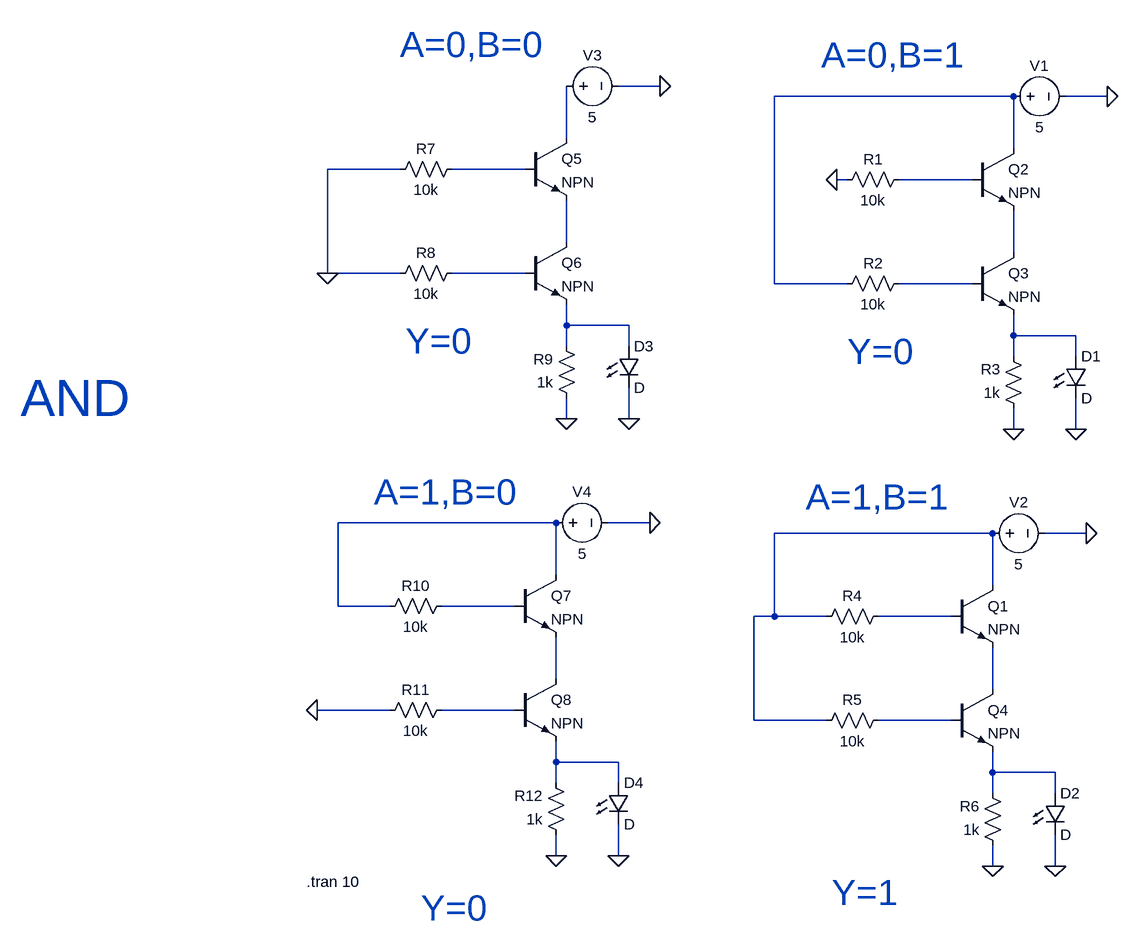
[diagram p0: schematic AndGate.asc]
AndGate.asc, the LTspice schematic file:
Version 4.1
SHEET 1 1204 1348
WIRE -224 48 -288 48
WIRE 320 64 -48 64
WIRE 464 64 400 64
WIRE -368 128 -368 48
WIRE 320 144 320 64
WIRE -624 176 -736 176
WIRE -432 176 -544 176
WIRE 64 192 48 192
WIRE 256 192 144 192
WIRE -368 288 -368 224
WIRE 320 304 320 240
WIRE -736 336 -736 176
WIRE -624 336 -736 336
WIRE -432 336 -544 336
WIRE -48 352 -48 64
WIRE 64 352 -48 352
WIRE 256 352 144 352
WIRE -368 416 -368 384
WIRE -272 416 -368 416
WIRE 320 432 320 400
WIRE 416 432 320 432
WIRE -368 448 -368 416
WIRE -272 448 -272 416
WIRE 320 464 320 432
WIRE 416 464 416 432
WIRE -368 560 -368 528
WIRE -272 560 -272 512
WIRE 320 576 320 544
WIRE 416 576 416 528
WIRE -384 720 -720 720
WIRE -240 720 -304 720
WIRE 288 736 -48 736
WIRE 432 736 368 736
WIRE -384 800 -384 720
WIRE 288 816 288 736
WIRE -720 848 -720 720
WIRE -640 848 -720 848
WIRE -448 848 -560 848
WIRE -48 864 -48 736
WIRE -48 864 -80 864
WIRE 32 864 -48 864
WIRE 224 864 112 864
WIRE -384 960 -384 896
WIRE 288 976 288 912
WIRE -640 1008 -752 1008
WIRE -448 1008 -560 1008
WIRE -80 1024 -80 864
WIRE 32 1024 -80 1024
WIRE 224 1024 112 1024
WIRE -384 1088 -384 1056
WIRE -288 1088 -384 1088
WIRE 288 1104 288 1072
WIRE 384 1104 288 1104
WIRE -384 1120 -384 1088
WIRE -288 1120 -288 1088
WIRE 288 1136 288 1104
WIRE 384 1136 384 1104
WIRE -384 1232 -384 1200
WIRE -288 1232 -288 1184
WIRE 288 1248 288 1216
WIRE 384 1248 384 1200
FLAG 464 64 0
FLAG 416 576 0
FLAG 320 576 0
FLAG 432 736 0
FLAG 384 1248 0
FLAG 288 1248 0
FLAG -224 48 0
FLAG -272 560 0
FLAG -368 560 0
FLAG -240 720 0
FLAG -288 1232 0
FLAG -384 1232 0
FLAG -736 336 0
FLAG 48 192 0
FLAG -752 1008 0
SYMBOL npn 256 144 R0
SYMATTR InstName Q2
SYMBOL npn 256 304 R0
SYMATTR InstName Q3
SYMBOL res 160 176 R90
WINDOW 0 0 56 VBottom 2
WINDOW 3 32 56 VTop 2
SYMATTR InstName R1
SYMATTR Value 10k
SYMBOL res 160 336 R90
WINDOW 0 0 56 VBottom 2
WINDOW 3 32 56 VTop 2
SYMATTR InstName R2
SYMATTR Value 10k
SYMBOL res 336 560 R180
WINDOW 0 36 76 Left 2
WINDOW 3 36 40 Left 2
SYMATTR InstName R3
SYMATTR Value 1k
SYMBOL voltage 304 64 R270
WINDOW 0 32 56 VTop 2
WINDOW 3 -32 56 VBottom 2
WINDOW 123 0 0 Left 0
WINDOW 39 0 0 Left 0
SYMATTR InstName V1
SYMATTR Value 5
SYMBOL LED 400 464 R0
SYMATTR InstName D1
SYMBOL npn 224 816 R0
SYMATTR InstName Q1
SYMBOL npn 224 976 R0
SYMATTR InstName Q4
SYMBOL res 128 848 R90
WINDOW 0 0 56 VBottom 2
WINDOW 3 32 56 VTop 2
SYMATTR InstName R4
SYMATTR Value 10k
SYMBOL res 128 1008 R90
WINDOW 0 0 56 VBottom 2
WINDOW 3 32 56 VTop 2
SYMATTR InstName R5
SYMATTR Value 10k
SYMBOL res 304 1232 R180
WINDOW 0 36 76 Left 2
WINDOW 3 36 40 Left 2
SYMATTR InstName R6
SYMATTR Value 1k
SYMBOL voltage 272 736 R270
WINDOW 0 32 56 VTop 2
WINDOW 3 -32 56 VBottom 2
WINDOW 123 0 0 Left 0
WINDOW 39 0 0 Left 0
SYMATTR InstName V2
SYMATTR Value 5
SYMBOL LED 368 1136 R0
SYMATTR InstName D2
SYMBOL npn -432 128 R0
SYMATTR InstName Q5
SYMBOL npn -432 288 R0
SYMATTR InstName Q6
SYMBOL res -528 160 R90
WINDOW 0 0 56 VBottom 2
WINDOW 3 32 56 VTop 2
SYMATTR InstName R7
SYMATTR Value 10k
SYMBOL res -528 320 R90
WINDOW 0 0 56 VBottom 2
WINDOW 3 32 56 VTop 2
SYMATTR InstName R8
SYMATTR Value 10k
SYMBOL res -352 544 R180
WINDOW 0 36 76 Left 2
WINDOW 3 36 40 Left 2
SYMATTR InstName R9
SYMATTR Value 1k
SYMBOL voltage -384 48 R270
WINDOW 0 32 56 VTop 2
WINDOW 3 -32 56 VBottom 2
WINDOW 123 0 0 Left 0
WINDOW 39 0 0 Left 0
SYMATTR InstName V3
SYMATTR Value 5
SYMBOL LED -288 448 R0
SYMATTR InstName D3
SYMBOL npn -448 800 R0
SYMATTR InstName Q7
SYMBOL npn -448 960 R0
SYMATTR InstName Q8
SYMBOL res -544 832 R90
WINDOW 0 0 56 VBottom 2
WINDOW 3 32 56 VTop 2
SYMATTR InstName R10
SYMATTR Value 10k
SYMBOL res -544 992 R90
WINDOW 0 0 56 VBottom 2
WINDOW 3 32 56 VTop 2
SYMATTR InstName R11
SYMATTR Value 10k
SYMBOL res -368 1216 R180
WINDOW 0 36 76 Left 2
WINDOW 3 36 40 Left 2
SYMATTR InstName R12
SYMATTR Value 1k
SYMBOL voltage -400 720 R270
WINDOW 0 32 56 VTop 2
WINDOW 3 -32 56 VBottom 2
WINDOW 123 0 0 Left 0
WINDOW 39 0 0 Left 0
SYMATTR InstName V4
SYMATTR Value 5
SYMBOL LED -304 1120 R0
SYMATTR InstName D4
TEXT -624 -16 Left 5 ;A=0,B=0
TEXT 24 0 Left 5 ;A=0,B=1
TEXT -664 672 Left 5 ;A=1,B=0
TEXT 0 680 Left 5 ;A=1,B=1
TEXT -768 1272 Left 2 !.tran 10
TEXT -1208 528 Left 6 ;AND
TEXT -616 440 Left 5 ;Y=0
TEXT 64 456 Left 5 ;Y=0
TEXT -592 1312 Left 5 ;Y=0
TEXT 40 1288 Left 5 ;Y=1

The netlist it stands for:
* AndGate.asc
Q2 N001 N004 N006 0 NPN
Q3 N006 N008 N010 0 NPN
R1 N004 0 10k
R2 N008 N001 10k
R3 0 N010 1k
V1 N001 0 5
D1 N010 0 D
Q1 N012 N014 N016 0 NPN
Q4 N016 N018 N020 0 NPN
R4 N014 N012 10k
R5 N018 N012 10k
R6 0 N020 1k
V2 N012 0 5
D2 N020 0 D
Q5 N002 N003 N005 0 NPN
Q6 N005 N007 N009 0 NPN
R7 N003 0 10k
R8 N007 0 10k
R9 0 N009 1k
V3 N002 0 5
D3 N009 0 D
Q7 N011 N013 N015 0 NPN
Q8 N015 N017 N019 0 NPN
R10 N013 N011 10k
R11 N017 0 10k
R12 0 N019 1k
V4 N011 0 5
D4 N019 0 D
.model D D
.lib standard.dio
.model NPN NPN
.model PNP PNP
.lib standard.bjt
* A=0,B=0
* A=0,B=1
* A=1,B=0
* A=1,B=1
.tran 10
* AND
* Y=0
* Y=0
* Y=0
* Y=1
.backanno
.end